# EAGLE design sc-7000z_supplyswitch (EAGLE 8.4.0)
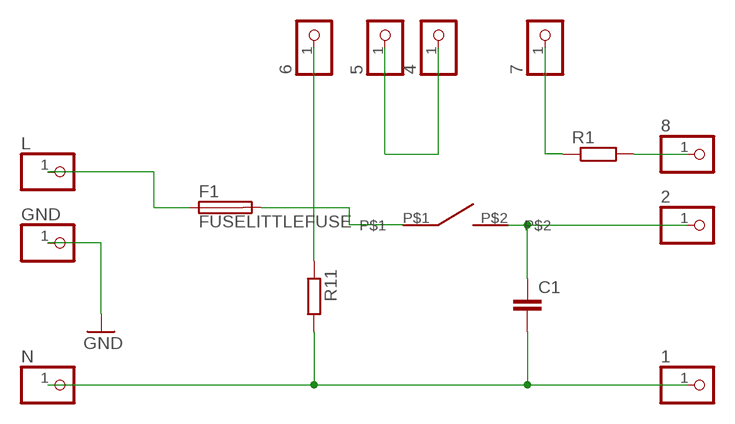
[diagram p0: schematic, sheet 1]

## Parts
1  PINHD-1X1  [1X01]
2  PINHD-1X1  [1X01]
4  PINHD-1X1  [1X01]
5  PINHD-1X1  [1X01]
6  PINHD-1X1  [1X01]
7  PINHD-1X1  [1X01]
8  PINHD-1X1  [1X01]
C1  C-EU150-054X183  [C150-054X183]
F1  FUSELITTLEFUSE  [LITTLEFUSE]
GND  PINHD-1X1  [1X01]
L  PINHD-1X1  [1X01]
N  PINHD-1X1  [1X01]
R1  R-EU_0309/12  [0309/12]
R11  R-EU_0309/12  [0309/12]
U$1  MY_SWITCH_ON_OFF  [KOLYSKA21X15]

## Nets
GND: GND.1
N$1: 7.1 R1.1
N$2: 8.1 R1.2
N$3: 6.1 R11.1
N$4: 4.1 5.1
N$5: F1.2 U$1.P$1
N$6: 2.1 C1.1 U$1.P$2
N$7: 1.1 C1.2 N.1 R11.2
N$8: F1.1 L.1

## Library data of the parts
1 2 4-8 GND L N = pinhead:PINHD-1X1: PIN HEADER
C1 = resistor:C-EU: CAPACITOR, European symbol
F1 = fuse:FUSE: Fuse; OC_FARNELL: unknown; OC_NEWARK: unknown
R1 R11 = resistor:R-EU_: RESISTOR, European symbol
U$1 = my_switch_on_off:MY_SWITCH_ON_OFF

## Board
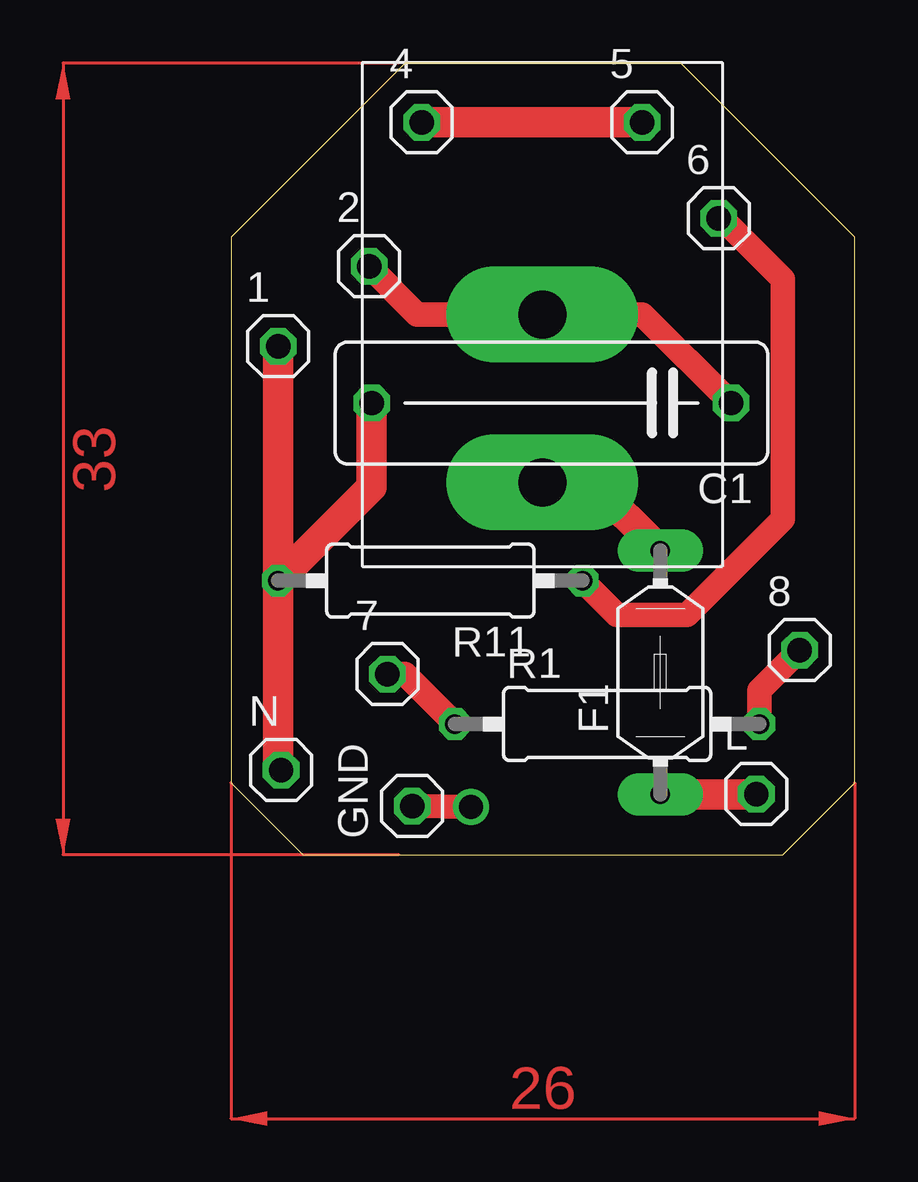
[diagram p1: board, top side]

Size 26 x 33 mm. Coordinates in mm from the lower left corner, seen from the top.
Outline: 0,3 3,0 23,0 26,3 26,25.75 18.75,33 7.25,33 0,25.75 0,3
Copper layers (1*16): Top 0.035mm / dielectric 1.5mm / Bottom 0.035mm
Design rules "default": minimum track width 6mil, minimum drill 0.35mm, track to track 6mil, track to pad 6mil, pad to pad 6mil, via to via 6mil, smd to smd 6mil, copper to edge 40mil, drill to drill 6mil, minimum pad ring 10mil, minimum via ring 8mil, stop-mask expansion 4mil, vias tented up to drill 0mil, thermal gap 10mil

### Footprints (pad centres in the part's own frame; a part is rotated, then mirrored left to right if it is on the bottom)
1X01 = drill 1.016 octagon: 1 0,0
C150-054X183 = drill 1.016 octagon: 1 -7.493,0; 2 7.493,0
LITTLEFUSE = drill 0.813 pad 1.778 long: 1 -5.08,0; 2 5.08,0
0309/12 = drill 0.813 octagon: 1 -6.35,0; 2 6.35,0
KOLYSKA21X15 = drill 2 pad 4 long: P$1 0,0; P$2 7,0

### Placement (x,y rotation side)
1  1.97,21.2 0 top
2  5.76,24.53 0 top
4  7.95,30.53 0 top
5  17.14,30.53 0 top
6  20.33,26.53 0 top
7  6.52,7.53 0 top
8  23.71,8.53 0 top
C1  13.36,18.83 180 top
F1  17.9,7.6 90 top
GND  7.55,2.03 90 top
L  21.9,2.53 0 top
N  2.09,3.53 0 top
R1  15.68,5.45 0 top
R11  8.31,11.43 180 top
U$1  12.97,15.53 90 top

### Tracks (layer width: path | path; a pad name or v marks a point on that pad's centre or on a via)
GND  (via drill 1)
  Top 1.016: GND.1 v10,2
N$1
  Top 1.016: R1.1 7.25,7.53 7.1
N$2
  Top 1.016: 8.1 22.03,6.85 R1.2
N$3
  Top 1.016: R11.1 16.09,10 19,10 23,14 23,24 20.47,26.53 6.1
N$4
  Top 1.27: 4.1 5.1
N$5
  Top 1.27: F1.2 15.05,15.53 U$1.P$1
N$6
  Top 1.016: C1.1 17.16,22.52 U$1.P$2 7.76,22.52 2.1
N$7
  Top 1.016: 1.97,11.79 R11.2 | 2.21,3.65 N.1
  Top 1.27: N.1 1.96,3.66 1.96,11 | 1.96,11 R11.2 5.87,15.33 C1.2 | 1.1 1.96,11
N$8
  Top 1.016: L.1
  Top 1.27: L.1 F1.1
(copper drawn outside any net)
  shapes: Top area x2